# Altium schematic sheet Sockets.SchDoc
size A3; SheetNumber: 4; SheetTotal: 4
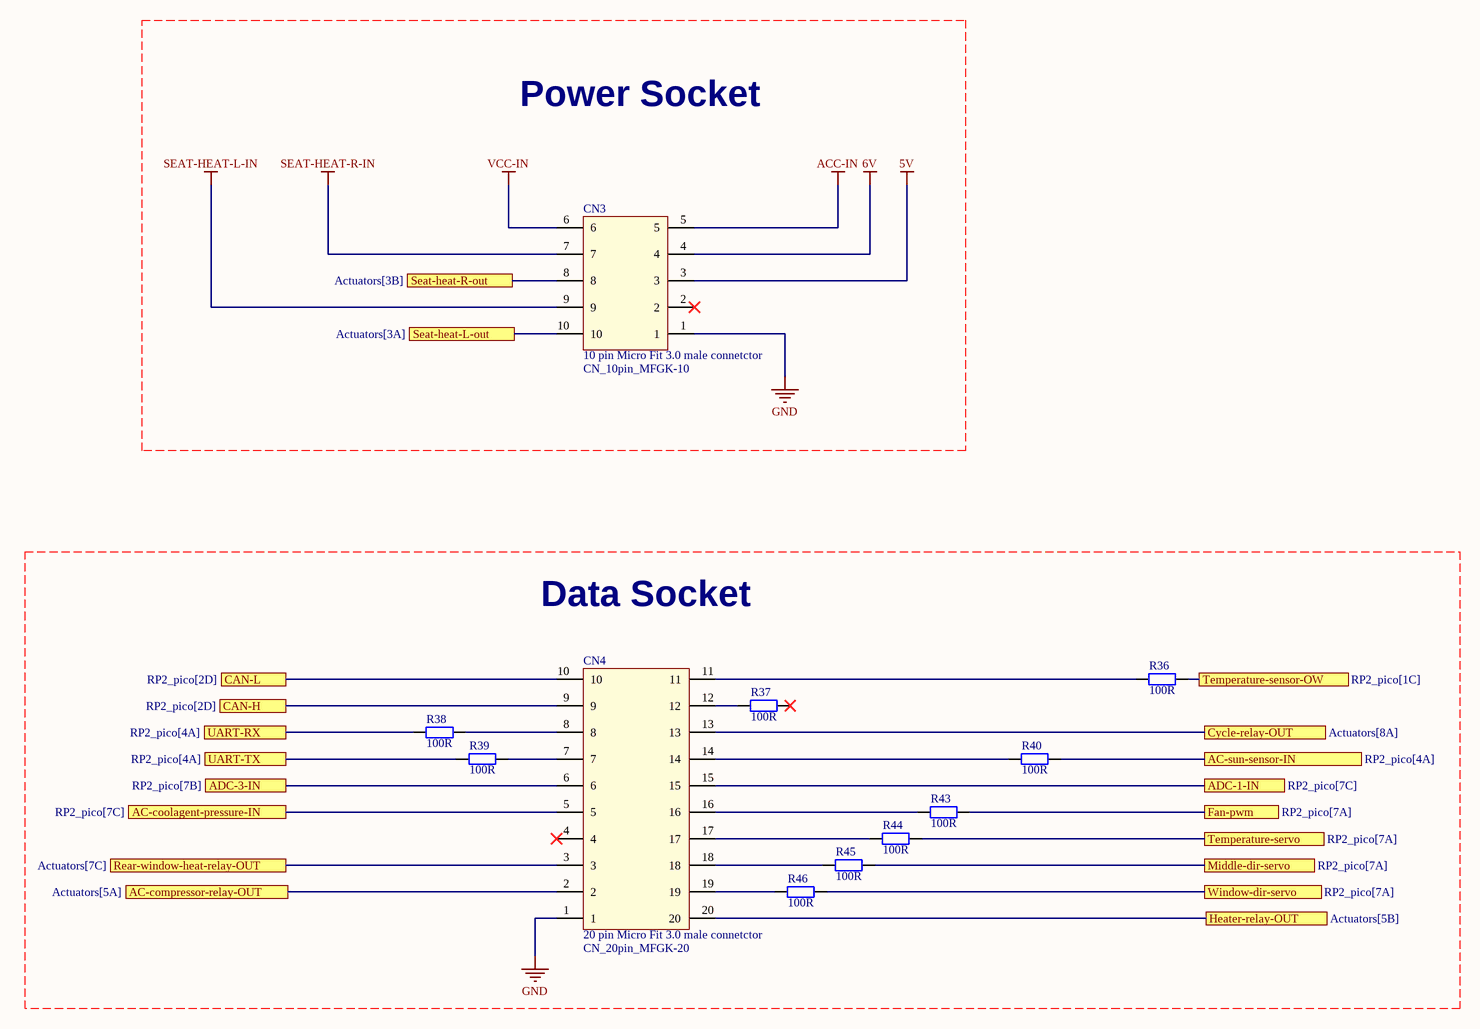
[diagram p0: Sockets.SchDoc]

## Parts
CN3  10 pin Micro Fit 3.0 male connetctor  [CN_10pin_MFGK-10]
CN4  20 pin Micro Fit 3.0 male connetctor  [CN_20pin_MFGK-20]
R36  Value1: 100R  [RESC2012X60N]  (hidden comment: RES)
R37  Value1: 100R  [RESC2012X60N]  (hidden comment: RES)
R38  Value1: 100R  [RESC2012X60N]  (hidden comment: RES)
R39  Value1: 100R  [RESC2012X60N]  (hidden comment: RES)
R40  Value1: 100R  [RESC2012X60N]  (hidden comment: RES)
R43  Value1: 100R  [RESC2012X60N]  (hidden comment: RES)
R44  Value1: 100R  [RESC2012X60N]  (hidden comment: RES)
R45  Value1: 100R  [RESC2012X60N]  (hidden comment: RES)
R46  Value1: 100R  [RESC2012X60N]  (hidden comment: RES)

## Ports
AC-compressor-relay-OUT (see Actuators[5A]), AC-coolagent-pressure-IN (see RP2_pico[7C]), AC-sun-sensor-IN (see RP2_pico[4A]), ADC-1-IN (see RP2_pico[7C]), ADC-3-IN (see RP2_pico[7B]), CAN-H (see RP2_pico[2D]), CAN-L (see RP2_pico[2D]), Cycle-relay-OUT (see Actuators[8A]), Fan-pwm (see RP2_pico[7A]), Heater-relay-OUT (see Actuators[5B]), Middle-dir-servo (see RP2_pico[7A]), Rear-window-heat-relay-OUT (see Actuators[7C]), Seat-heat-L-out (see Actuators[3A]), Seat-heat-R-out (see Actuators[3B]), Temperature-sensor-OW (see RP2_pico[1C]), Temperature-servo (see RP2_pico[7A]), UART-RX (see RP2_pico[4A]), UART-TX (see RP2_pico[4A]), Window-dir-servo (see RP2_pico[7A])

## Nets
5V: CN3.3
6V: CN3.4
ACC-IN: CN3.5
GND: CN3.1 CN4.1
SEAT-HEAT-L-IN: CN3.9
SEAT-HEAT-R-IN: CN3.7
VCC-IN: CN3.6
AC-compressor-relay-OUT: CN4.2 ; port AC-compressor-relay-OUT
AC-coolagent-pressure-IN: CN4.5 ; port AC-coolagent-pressure-IN
AC-sun-sensor-IN: R40.2 ; port AC-sun-sensor-IN
ADC-1-IN: CN4.15 ; port ADC-1-IN
ADC-3-IN: CN4.6 ; port ADC-3-IN
CAN-H: CN4.9 ; port CAN-H
CAN-L: CN4.10 ; port CAN-L
Cycle-relay-OUT: CN4.13 ; port Cycle-relay-OUT
Fan-pwm: R43.2 ; port Fan-pwm
Heater-relay-OUT: CN4.20 ; port Heater-relay-OUT
Middle-dir-servo: R45.2 ; port Middle-dir-servo
Rear-window-heat-relay-OUT: CN4.3 ; port Rear-window-heat-relay-OUT
Seat-heat-L-out: CN3.10 ; port Seat-heat-L-out
Seat-heat-R-out: CN3.8 ; port Seat-heat-R-out
Temperature-sensor-OW: R36.2 ; port Temperature-sensor-OW
Temperature-servo: R44.2 ; port Temperature-servo
UART-RX: R38.2 ; port UART-RX
UART-TX: R39.2 ; port UART-TX
Window-dir-servo: R46.2 ; port Window-dir-servo
NetCN4_7: CN4.7 R39.1
NetCN4_8: CN4.8 R38.1
NetCN4_11: CN4.11 R36.1
NetCN4_12: CN4.12 R37.1
NetCN4_14: CN4.14 R40.1
NetCN4_16: CN4.16 R43.1
NetCN4_17: CN4.17 R44.1
NetCN4_18: CN4.18 R45.1
NetCN4_19: CN4.19 R46.1

Not connected (* = marked no-connect by the designer): CN3 2*; CN4 4*; R37 2*

## Notes on the sheet
- Power Socket
- Data Socket

## Library data of the parts
CN3 = 02_10137: Molex, Micro-Fit 3.0, 43045, 10 Way, 2 Row, Right Angle PCB Header; Manufacturer PN: 43045-1000; AutoId: 179; Value2: 10 pin; Value3: 3.0 mm; DeviceType: Connector_; Id: 02_10137; Value1: CN_10pin_MFGK-10; Manufacturer: Molex; MountType: SMT; ComponentLink1Description: Datasheet; ComponentLink1URL: X:\01_Datasheets\CN_molex_micro_fit_430045.pdf; ComponentLink2Description: ComponentVerificationSheet; ComponentLink2URL: X:\02_ComponentVerificationSheets\; Supplier 1: kosmodrom.ua; Supplier Part Number 1: 00-00041120
CN4 = 02_10136: Molex, Micro-Fit 3.0, 43045, 20 Way, 2 Row, Right Angle PCB Header; Manufacturer PN: 43045-2000; AutoId: 177; Value2: 20 pin; Value3: 3.0 mm; DeviceType: Connector_; Id: 02_10136; Value1: CN_20pin_MFGK-20; Manufacturer: Molex; MountType: SMT; ComponentLink1Description: Datasheet; ComponentLink1URL: X:\01_Datasheets\CN_molex_micro_fit_430045.pdf; ComponentLink2Description: ComponentVerificationSheet; ComponentLink2URL: X:\02_ComponentVerificationSheets\; Supplier 1: kosmodrom.ua; Supplier Part Number 1: 00-00041123
R36-R40 R43-R46 = 15_00317: RESISTOR, 0805, 100R, 1%, SMD; Manufacturer: Yageo; Manufacturer PN: RC0805FR-07100R; AutoId: 317; Value2: 0W125; SubType: Metal film; Id: 15_00317; DeviceType: resistor; Status: 2 - Checked and Approved; MountType: SMT; ComponentLink1Description: Datasheet; ComponentLink1URL: X:\01_Datasheets\RES_YAGEO_RC0805FR.pdf; Supplier 1: Farnell; Supplier Part Number 1: 9237364